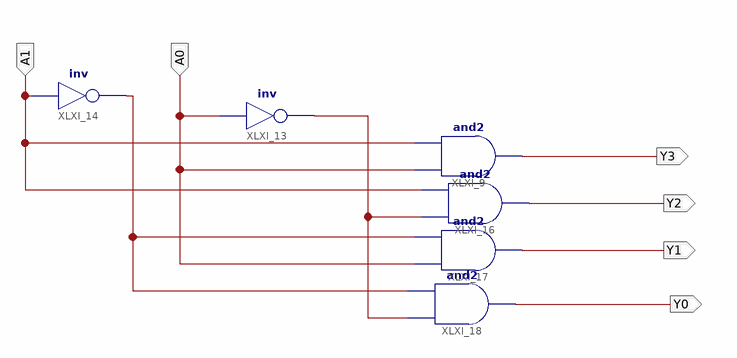
[diagram p0: schematic sheet 1]
// Xilinx ISE schematic mux.sch (spartan3e) as structural Verilog: 6 symbols, 6 ports
module mux (
  input  A1,
  input  A0,
  output Y2,
  output Y0,
  output Y3,
  output Y1
);

  wire XLXN_23, XLXN_28;

  not XLXI_14 (XLXN_23, A1);
  not XLXI_13 (XLXN_28, A0);
  and XLXI_18 (Y0, XLXN_28, XLXN_23);
  and XLXI_17 (Y1, A0, XLXN_23);
  and XLXI_9 (Y3, A0, A1);
  and XLXI_16 (Y2, XLXN_28, A1);
endmodule
